# EAGLE schematic encoder_TCUT1350_v5 (EAGLE 9.7.0)
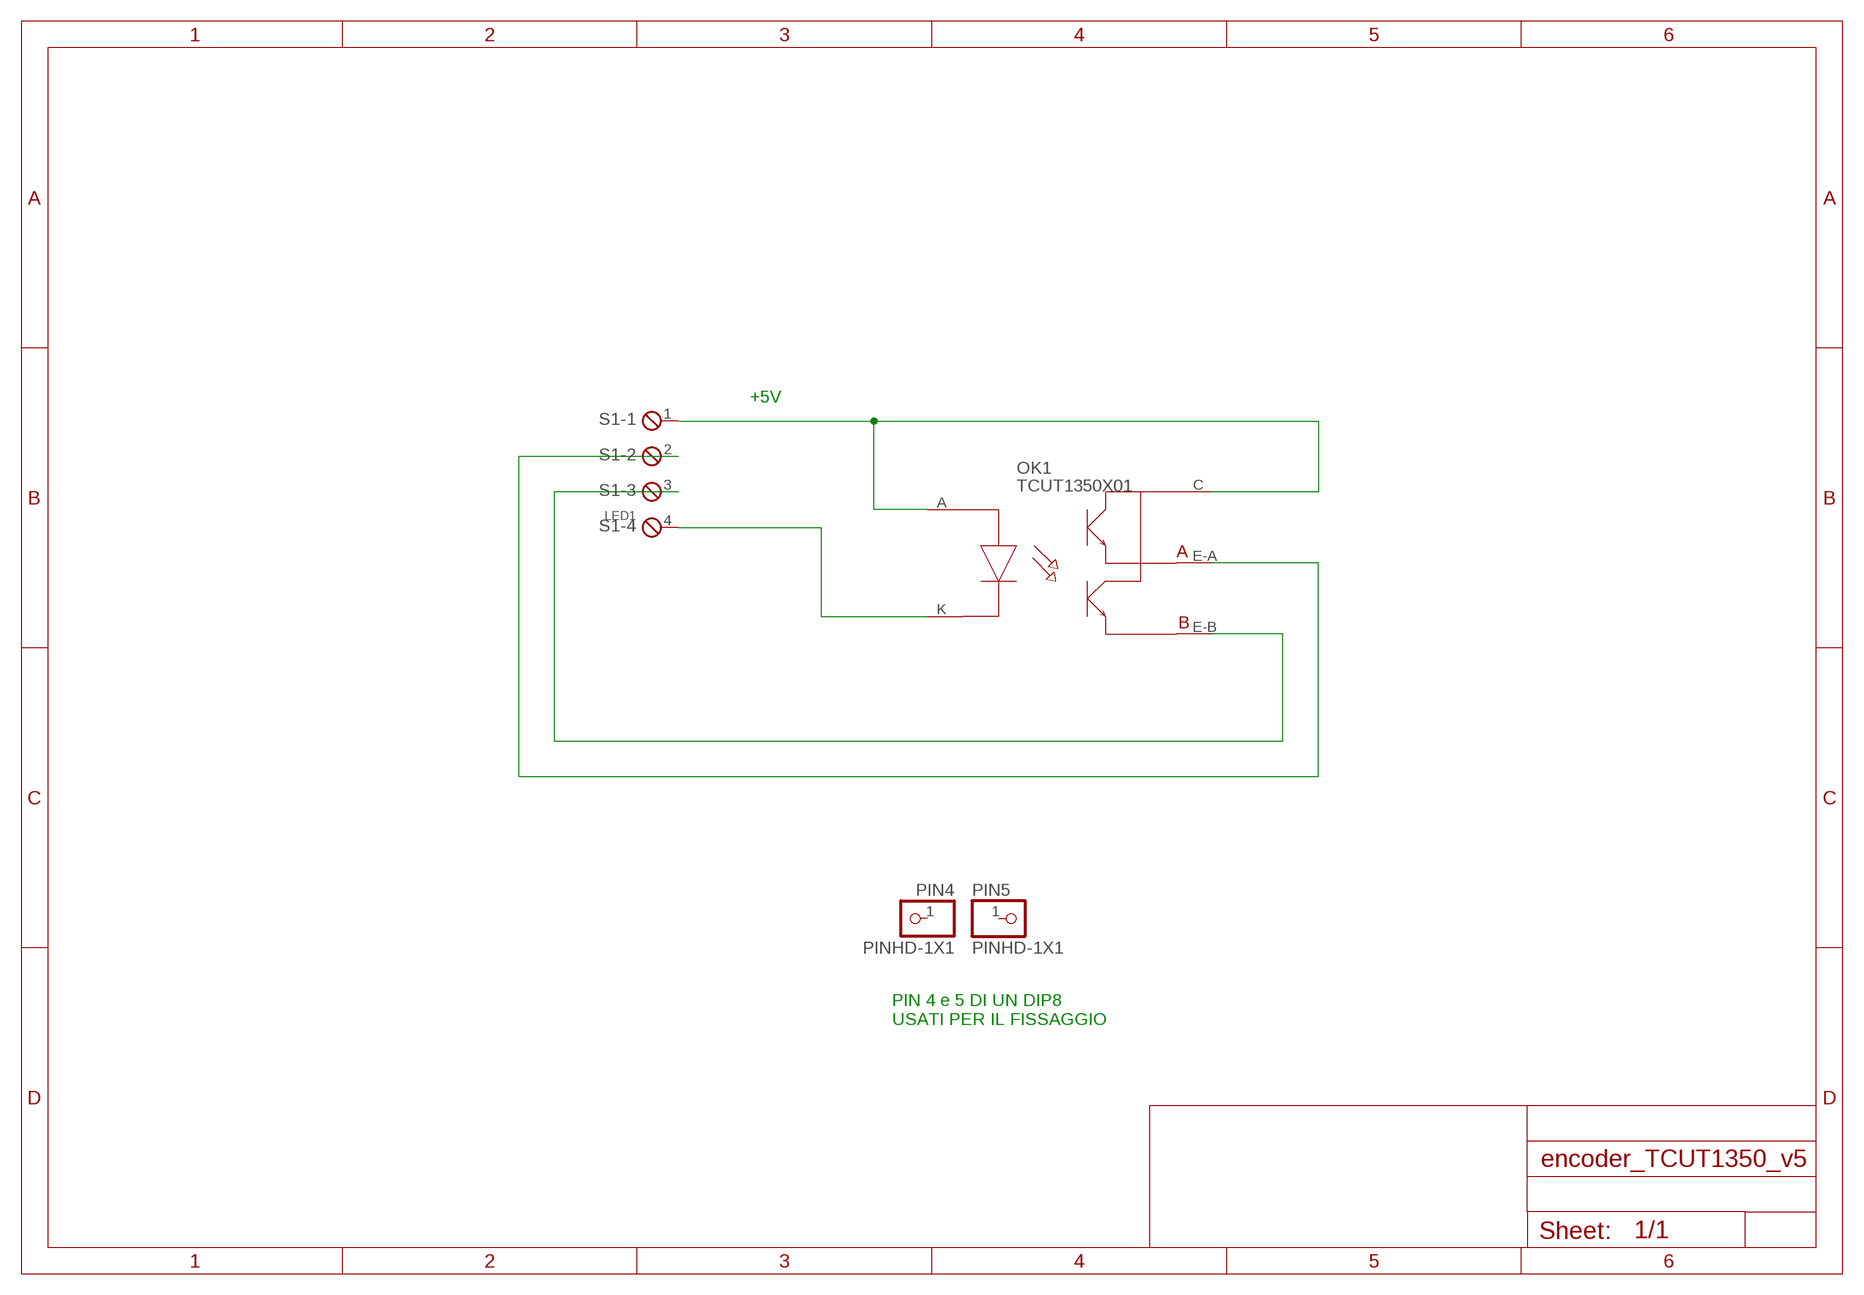
[diagram p0: schematic, sheet 1]

## Parts
OK1  TCUT1350X01  [TCUT1350X01]
PIN4  PINHD-1X1  [1X01]
PIN5  PINHD-1X1  [1X01]
S1  MPT4  [4POL254]

## Nets
+5V: OK1.A OK1.C S1.1
LED1: OK1.K S1.4
N$1: OK1.E-B S1.3
N$2: OK1.E-A S1.2
Unconnected: PIN4.1 PIN5.1

## Notes on the sheet
- +5V
- PIN 4 e 5 DI UN DIP8
  USATI PER IL FISSAGGIO

## Library data of the parts
OK1 = opto-vishay:TCUT1350X01
PIN4 PIN5 = Connector:PINHD-1X1: PIN HEADER; CATEGORY: CONNECTOR; SUB-CATEGORY: PIN-HEADER
S1 = con-phoenix-254-custom:MPT4: PHOENIX CONNECTOR; OC_FARNELL: unknown; OC_NEWARK: unknown